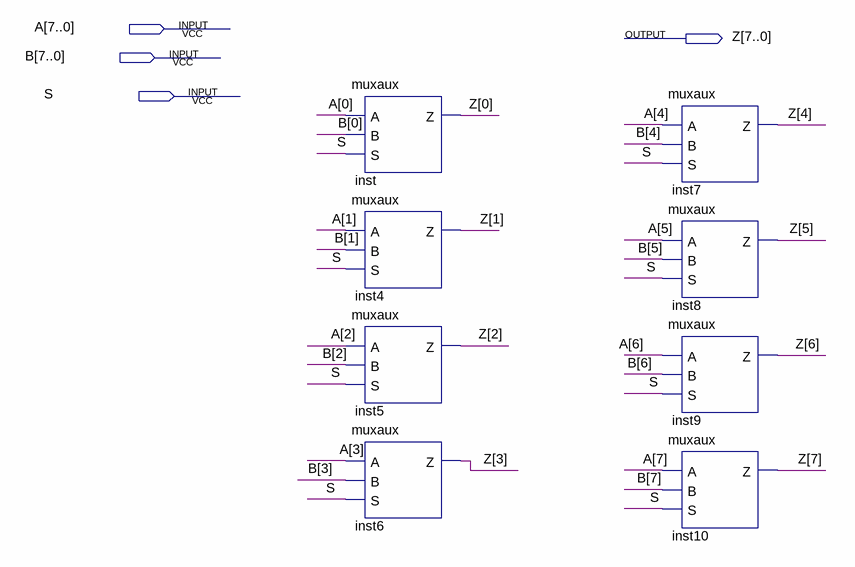
[diagram p0: schematic sheet]
// Quartus schematic mux2_1.bdf as structural Verilog: 8 symbols, 4 pins
module mux2_1 (
  input  [7:0] A,
  input  [7:0] B,
  input  S,
  output [7:0] Z
);

  muxaux inst (.A(A[0]), .B(B[0]), .S(S), .Z(Z[0]));
  muxaux inst4 (.A(A[1]), .B(B[1]), .S(S), .Z(Z[1]));
  muxaux inst5 (.A(A[2]), .B(B[2]), .S(S), .Z(Z[2]));
  muxaux inst6 (.A(A[3]), .B(B[3]), .S(S), .Z(Z[3]));
  muxaux inst7 (.A(A[4]), .B(B[4]), .S(S), .Z(Z[4]));
  muxaux inst8 (.A(A[5]), .B(B[5]), .S(S), .Z(Z[5]));
  muxaux inst9 (.A(A[6]), .B(B[6]), .S(S), .Z(Z[6]));
  muxaux inst10 (.A(A[7]), .B(B[7]), .S(S), .Z(Z[7]));
endmodule
